# EAGLE schematic PKG900000001454 (EAGLE 7.7.0)

## Sheet 1 of 5
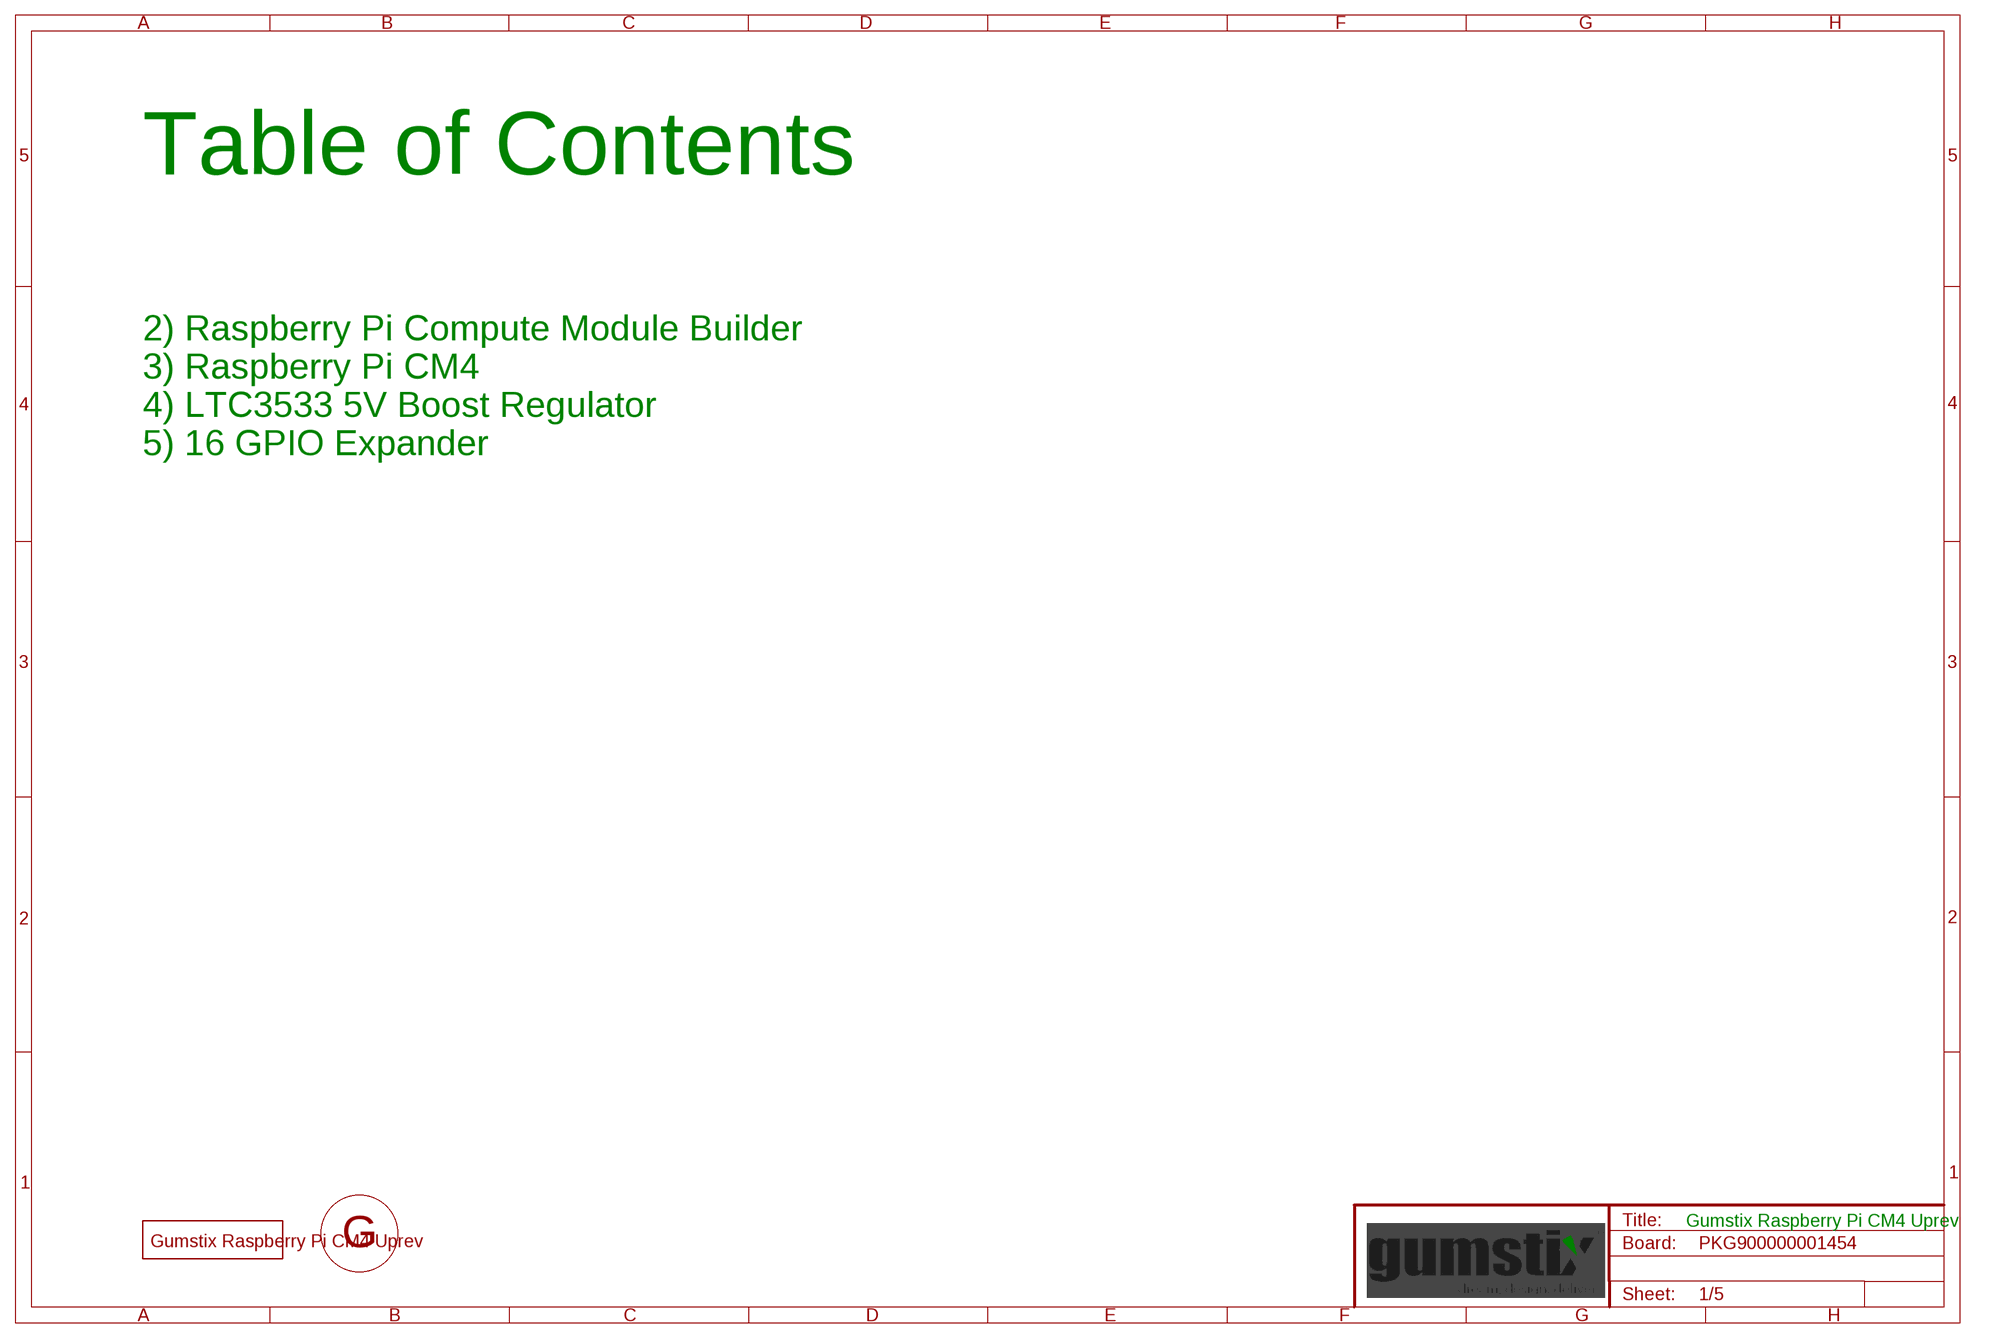
[diagram p0: schematic, sheet 1]

### Parts
FD1  DNP  FIDUCIAL  [FIDUCIAL]
FD2  DNP  FIDUCIAL  [FIDUCIAL]
FD3  DNP  FIDUCIAL  [FIDUCIAL]
FD4  DNP  FIDUCIAL  [FIDUCIAL]
FD5  DNP  FIDUCIAL  [FIDUCIAL]
FD6  DNP  FIDUCIAL  [FIDUCIAL]
U$3  DNP  GEPPETTO_LABEL"  [GEPPETTO_LABEL]
U$4  DNP  GEPPETTO_LOGO10X10  [GEPPETTO_LOGO_SILK10]

### Notes on the sheet
- Table of Contents
- 2) Raspberry Pi Compute Module Builder
- 3) Raspberry Pi CM4
- 4) LTC3533 5V Boost Regulator
- 5) 16 GPIO Expander
- Gumstix Raspberry Pi CM4 Uprev

## Sheet 2 of 5
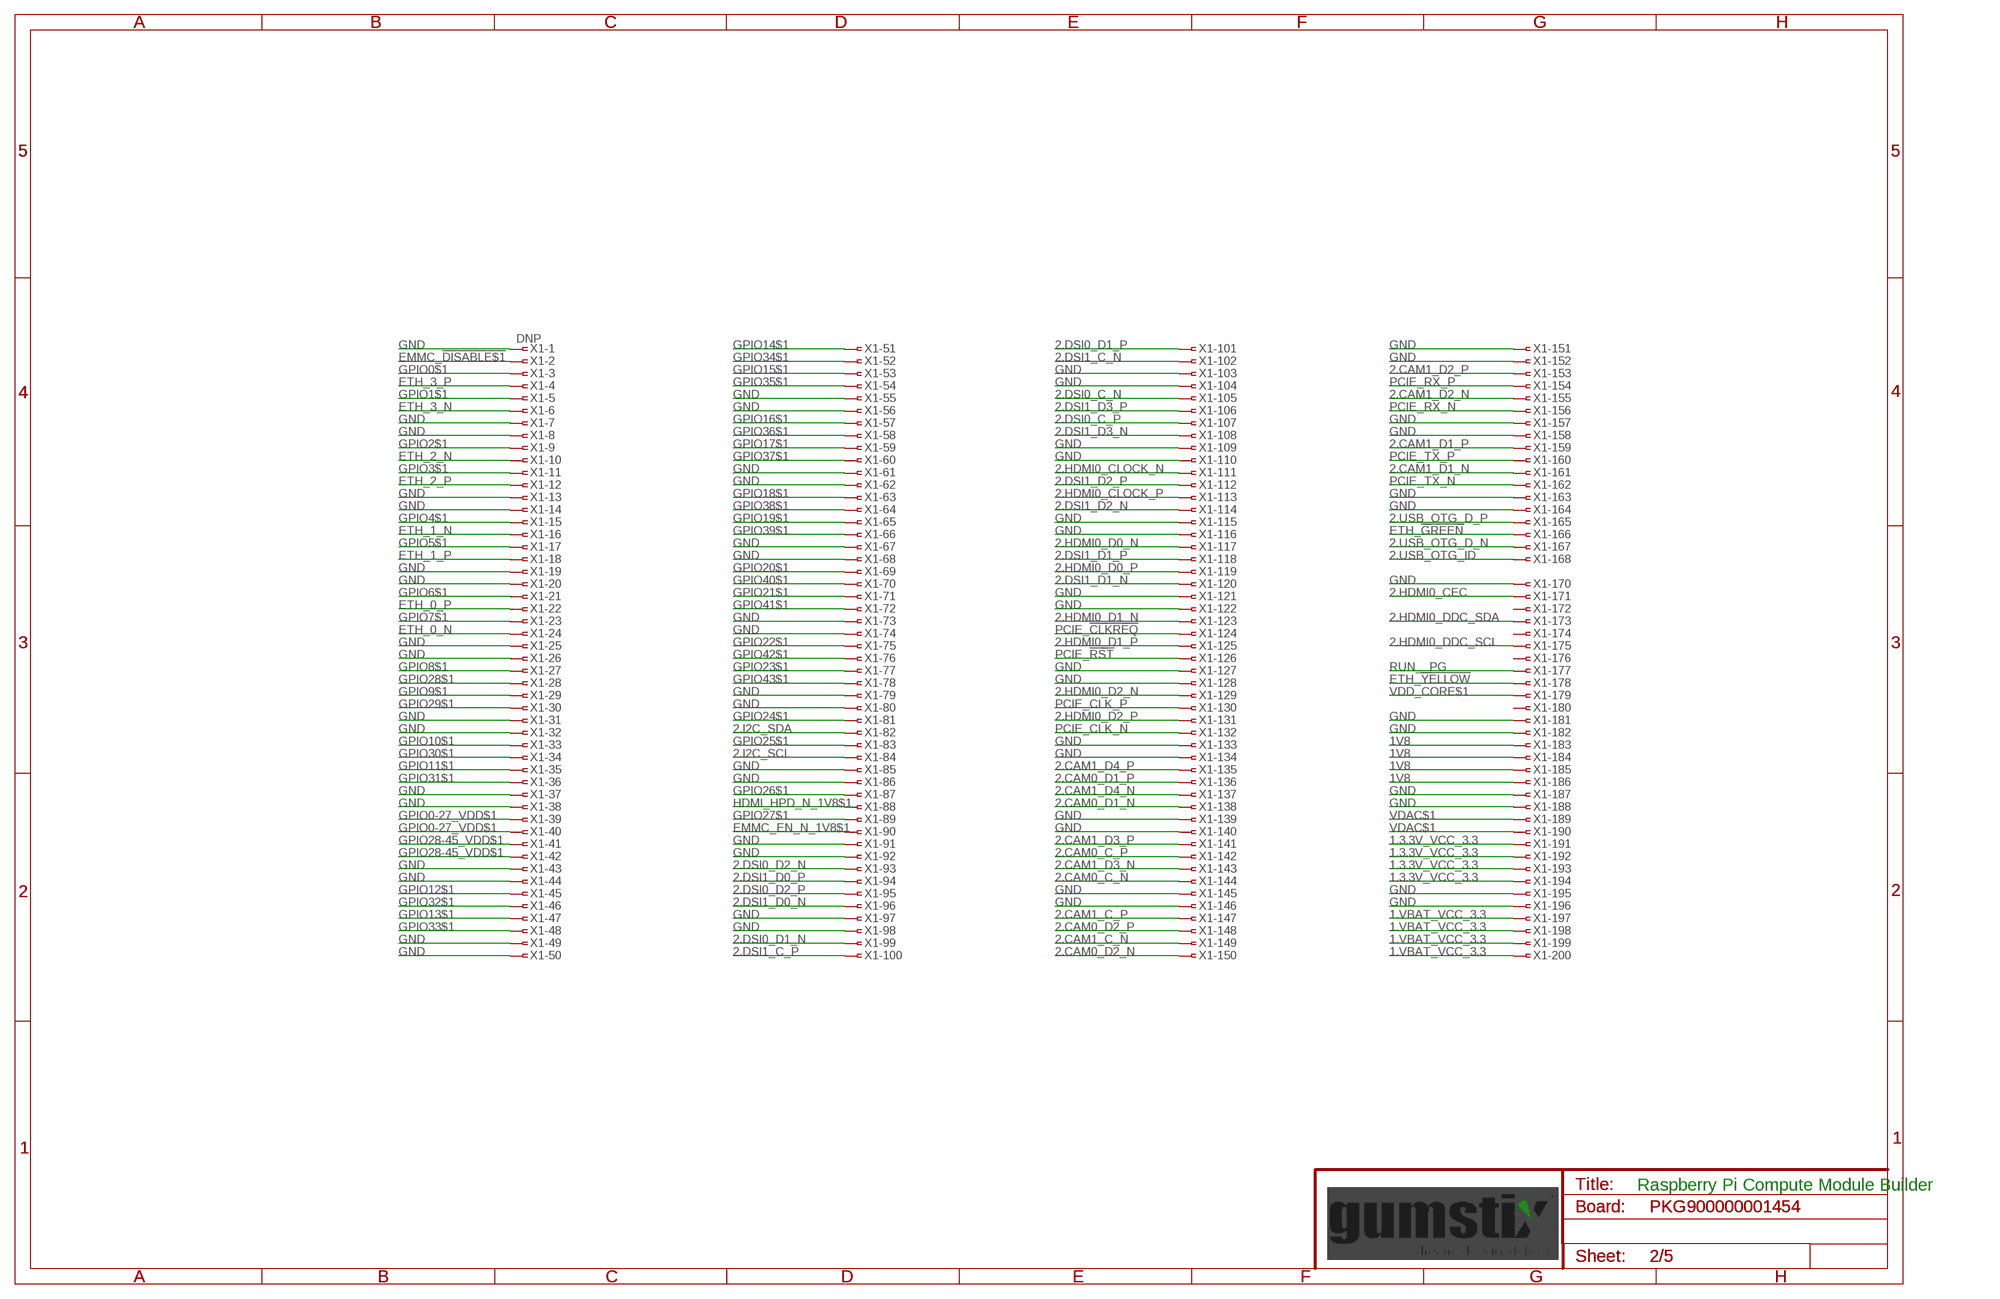
[diagram p1: schematic, sheet 2]

### Parts
X1  DNP  1376408SLOT_1.8V_MOD  [SLOT-1376408-1_1.8V_MOD]

### Nets
1.3.3V_VCC_3.3 [supply]: X1.191 X1.192 X1.193 X1.194 ; also sheet 3,5
1.VBAT_VCC_3.3 [supply]: X1.197 X1.198 X1.199 X1.200 ; also sheet 4
1V8 [supply]: X1.183 X1.184 X1.185 X1.186
2.CAM0_C_N [HDMI]: X1.144 ; also sheet 3
2.CAM0_C_P [HDMI]: X1.142 ; also sheet 3
2.CAM0_D1_N [HDMI]: X1.138 ; also sheet 3
2.CAM0_D1_P [HDMI]: X1.136 ; also sheet 3
2.CAM0_D2_N [HDMI]: X1.150 ; also sheet 3
2.CAM0_D2_P [HDMI]: X1.148 ; also sheet 3
2.CAM1_C_N [HDMI]: X1.149 ; also sheet 3
2.CAM1_C_P [HDMI]: X1.147 ; also sheet 3
2.CAM1_D1_N [HDMI]: X1.161 ; also sheet 3
2.CAM1_D1_P [HDMI]: X1.159 ; also sheet 3
2.CAM1_D2_N [HDMI]: X1.155 ; also sheet 3
2.CAM1_D2_P [HDMI]: X1.153 ; also sheet 3
2.CAM1_D3_N [HDMI]: X1.143 ; also sheet 3
2.CAM1_D3_P [HDMI]: X1.141 ; also sheet 3
2.CAM1_D4_N [HDMI]: X1.137 ; also sheet 3
2.CAM1_D4_P [HDMI]: X1.135 ; also sheet 3
2.DSI0_C_N [HDMI]: X1.105 ; also sheet 3
2.DSI0_C_P [HDMI]: X1.107 ; also sheet 3
2.DSI0_D1_N [HDMI]: X1.99 ; also sheet 3
2.DSI0_D1_P [HDMI]: X1.101 ; also sheet 3
2.DSI0_D2_N [HDMI]: X1.93 ; also sheet 3
2.DSI0_D2_P [HDMI]: X1.95 ; also sheet 3
2.DSI1_C_N [HDMI]: X1.102 ; also sheet 3
2.DSI1_C_P [HDMI]: X1.100 ; also sheet 3
2.DSI1_D0_N [HDMI]: X1.96 ; also sheet 3
2.DSI1_D0_P [HDMI]: X1.94 ; also sheet 3
2.DSI1_D1_N [HDMI]: X1.120 ; also sheet 3
2.DSI1_D1_P [HDMI]: X1.118 ; also sheet 3
2.DSI1_D2_N [HDMI]: X1.114 ; also sheet 3
2.DSI1_D2_P [HDMI]: X1.112 ; also sheet 3
2.DSI1_D3_N [HDMI]: X1.108 ; also sheet 3
2.DSI1_D3_P [HDMI]: X1.106 ; also sheet 3
2.HDMI0_CEC: X1.171 ; also sheet 3
2.HDMI0_CLOCK_N [HDMI]: X1.111 ; also sheet 3
2.HDMI0_CLOCK_P [HDMI]: X1.113 ; also sheet 3
2.HDMI0_D0_N [HDMI]: X1.117 ; also sheet 3
2.HDMI0_D0_P [HDMI]: X1.119 ; also sheet 3
2.HDMI0_D1_N [HDMI]: X1.123 ; also sheet 3
2.HDMI0_D1_P [HDMI]: X1.125 ; also sheet 3
2.HDMI0_D2_N [HDMI]: X1.129 ; also sheet 3
2.HDMI0_D2_P [HDMI]: X1.131 ; also sheet 3
2.HDMI0_DDC_SCL: X1.175 ; also sheet 3
2.HDMI0_DDC_SDA: X1.173 ; also sheet 3
2.I2C_SCL: X1.84 ; also sheet 3
2.I2C_SDA: X1.82 ; also sheet 3
2.USB_OTG_D_N [USB]: X1.167 ; also sheet 3
2.USB_OTG_D_P [USB]: X1.165 ; also sheet 3
2.USB_OTG_ID: X1.168 ; also sheet 3
EMMC_!DISABLE$1: X1.2 ; also sheet 3
EMMC_EN_N_1V8$1: X1.90
ETH_0_N [HDMI]: X1.24 ; also sheet 3
ETH_0_P [HDMI]: X1.22 ; also sheet 3
ETH_1_N [HDMI]: X1.16 ; also sheet 3
ETH_1_P [HDMI]: X1.18 ; also sheet 3
ETH_2_N [HDMI]: X1.10 ; also sheet 3
ETH_2_P [HDMI]: X1.12 ; also sheet 3
ETH_3_N [HDMI]: X1.6 ; also sheet 3
ETH_3_P [HDMI]: X1.4 ; also sheet 3
ETH_!GREEN: X1.166 ; also sheet 3
ETH_!YELLOW: X1.178 ; also sheet 3
GND [supply]: X1.1 X1.7 X1.8 X1.13 X1.14 X1.19 X1.20 X1.25 X1.26 X1.31 X1.32 X1.37 X1.38 X1.43 X1.44 X1.49 X1.50 X1.55 X1.56 X1.61 X1.62 X1.67 X1.68 X1.73 X1.74 X1.79 X1.80 X1.85 X1.86 X1.91 X1.92 X1.97 X1.98 X1.103 X1.104 X1.109 X1.110 X1.115 X1.116 X1.121 X1.122 X1.127 X1.128 X1.133 X1.134 X1.139 X1.140 X1.145 X1.146 X1.151 X1.152 X1.157 X1.158 X1.163 X1.164 X1.170 X1.181 X1.182 X1.187 X1.188 X1.195 X1.196 ; also sheet 3,4,5
GPIO0$1: X1.3 ; also sheet 3
GPIO0-27_VDD$1 [supply]: X1.39 X1.40
GPIO1$1: X1.5 ; also sheet 3
GPIO2$1: X1.9 ; also sheet 3,5
GPIO3$1: X1.11 ; also sheet 3,5
GPIO4$1: X1.15 ; also sheet 3
GPIO5$1: X1.17 ; also sheet 3
GPIO6$1: X1.21 ; also sheet 3
GPIO7$1: X1.23 ; also sheet 3
GPIO8$1: X1.27 ; also sheet 3
GPIO9$1: X1.29 ; also sheet 3
GPIO10$1: X1.33 ; also sheet 3
GPIO11$1: X1.35 ; also sheet 3
GPIO12$1: X1.45 ; also sheet 3
GPIO13$1: X1.47 ; also sheet 3
GPIO14$1: X1.51 ; also sheet 3
GPIO15$1: X1.53 ; also sheet 3
GPIO16$1: X1.57 ; also sheet 3
GPIO17$1: X1.59 ; also sheet 3
GPIO18$1: X1.63 ; also sheet 3
GPIO19$1: X1.65 ; also sheet 3
GPIO20$1: X1.69 ; also sheet 3
GPIO21$1: X1.71 ; also sheet 3
GPIO22$1: X1.75 ; also sheet 3
GPIO23$1: X1.77 ; also sheet 3
GPIO24$1: X1.81 ; also sheet 3
GPIO25$1: X1.83 ; also sheet 3
GPIO26$1: X1.87 ; also sheet 3
GPIO27$1: X1.89 ; also sheet 3
GPIO28$1: X1.28 ; also sheet 5
GPIO28-45_VDD$1 [supply]: X1.41 X1.42
GPIO29$1: X1.30 ; also sheet 5
GPIO30$1: X1.34 ; also sheet 5
GPIO31$1: X1.36 ; also sheet 5
GPIO32$1: X1.46 ; also sheet 5
GPIO33$1: X1.48 ; also sheet 5
GPIO34$1: X1.52 ; also sheet 5
GPIO35$1: X1.54 ; also sheet 5
GPIO36$1: X1.58 ; also sheet 5
GPIO37$1: X1.60 ; also sheet 5
GPIO38$1: X1.64 ; also sheet 5
GPIO39$1: X1.66 ; also sheet 5
GPIO40$1: X1.70 ; also sheet 5
GPIO41$1: X1.72 ; also sheet 5
GPIO42$1: X1.76 ; also sheet 5
GPIO43$1: X1.78 ; also sheet 5
HDMI_HPD_N_1V8$1: X1.88 ; also sheet 3
PCIE_!CLKREQ: X1.124 ; also sheet 3
PCIE_!RST: X1.126 ; also sheet 3
PCIE_CLK_N [USB]: X1.132 ; also sheet 3
PCIE_CLK_P [USB]: X1.130 ; also sheet 3
PCIE_RX_N [USB]: X1.156 ; also sheet 3
PCIE_RX_P [USB]: X1.154 ; also sheet 3
PCIE_TX_N [USB]: X1.162 ; also sheet 3
PCIE_TX_P [USB]: X1.160 ; also sheet 3
RUN__PG: X1.177 ; also sheet 3
VDAC$1 [supply]: X1.189 X1.190
VDD_CORE$1: X1.179
Unconnected: X1.169 X1.172 X1.174 X1.176 X1.180

### Notes on the sheet
- Raspberry Pi Compute Module Builder

## Sheet 3 of 5
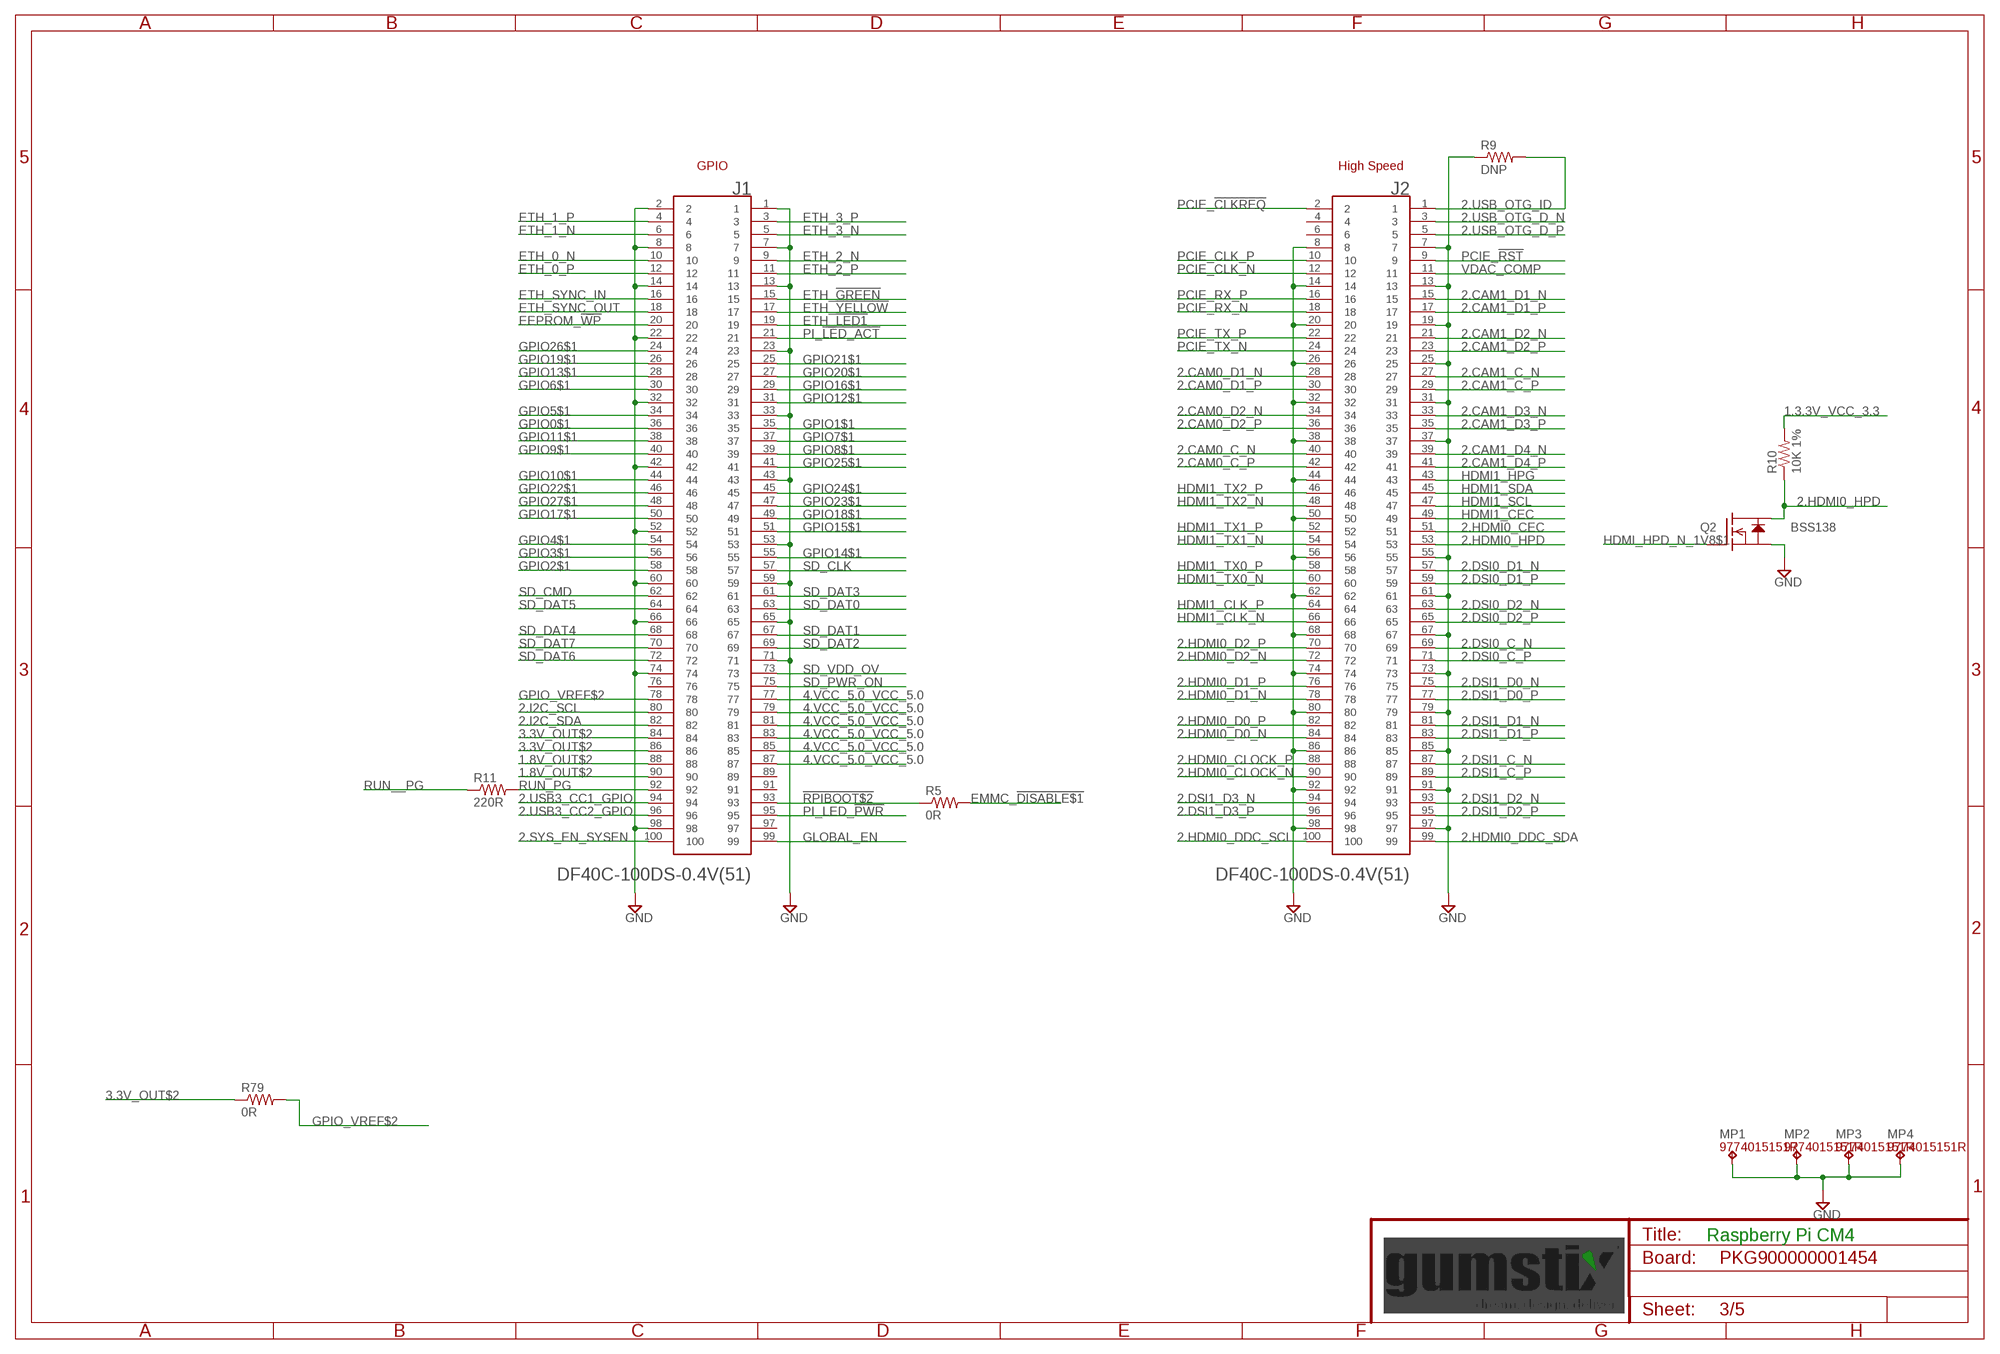
[diagram p2: schematic, sheet 3]

### Parts
J1  DF40C-100DS-0.4V(51)  [HRS_DF40C-100DS-0.4V(51)]
J2  DF40C-100DS-0.4V(51)  [HRS_DF40C-100DS-0.4V(51)]
MP1  9774015151R  BULLET_CONN2.5MM  [WA-SMSI_9774___151]
MP2  9774015151R  BULLET_CONN2.5MM  [WA-SMSI_9774___151]
MP3  9774015151R  BULLET_CONN2.5MM  [WA-SMSI_9774___151]
MP4  9774015151R  BULLET_CONN2.5MM  [WA-SMSI_9774___151]
Q2  BSS138  [SOT23]
R5  0R  R0201  [0201]
R9  DNP  R0201  [0201]
R10  10K 1%  R0201  [0201]
R11  220R  R0402  [0402]
R79  0R  R0201  [0201]

### Nets
1.3.3V_VCC_3.3 [supply]: R10.2 ; also sheet 2,5
1.8V_OUT$2 [supply]: J1.88 J1.90
2.CAM0_C_N [HDMI]: J2.40 ; also sheet 2
2.CAM0_C_P [HDMI]: J2.42 ; also sheet 2
2.CAM0_D1_N [HDMI]: J2.28 ; also sheet 2
2.CAM0_D1_P [HDMI]: J2.30 ; also sheet 2
2.CAM0_D2_N [HDMI]: J2.34 ; also sheet 2
2.CAM0_D2_P [HDMI]: J2.36 ; also sheet 2
2.CAM1_C_N [HDMI]: J2.27 ; also sheet 2
2.CAM1_C_P [HDMI]: J2.29 ; also sheet 2
2.CAM1_D1_N [HDMI]: J2.15 ; also sheet 2
2.CAM1_D1_P [HDMI]: J2.17 ; also sheet 2
2.CAM1_D2_N [HDMI]: J2.21 ; also sheet 2
2.CAM1_D2_P [HDMI]: J2.23 ; also sheet 2
2.CAM1_D3_N [HDMI]: J2.33 ; also sheet 2
2.CAM1_D3_P [HDMI]: J2.35 ; also sheet 2
2.CAM1_D4_N [HDMI]: J2.39 ; also sheet 2
2.CAM1_D4_P [HDMI]: J2.41 ; also sheet 2
2.DSI0_C_N [HDMI]: J2.69 ; also sheet 2
2.DSI0_C_P [HDMI]: J2.71 ; also sheet 2
2.DSI0_D1_N [HDMI]: J2.57 ; also sheet 2
2.DSI0_D1_P [HDMI]: J2.59 ; also sheet 2
2.DSI0_D2_N [HDMI]: J2.63 ; also sheet 2
2.DSI0_D2_P [HDMI]: J2.65 ; also sheet 2
2.DSI1_C_N [HDMI]: J2.87 ; also sheet 2
2.DSI1_C_P [HDMI]: J2.89 ; also sheet 2
2.DSI1_D0_N [HDMI]: J2.75 ; also sheet 2
2.DSI1_D0_P [HDMI]: J2.77 ; also sheet 2
2.DSI1_D1_N [HDMI]: J2.81 ; also sheet 2
2.DSI1_D1_P [HDMI]: J2.83 ; also sheet 2
2.DSI1_D2_N [HDMI]: J2.93 ; also sheet 2
2.DSI1_D2_P [HDMI]: J2.95 ; also sheet 2
2.DSI1_D3_N [HDMI]: J2.94 ; also sheet 2
2.DSI1_D3_P [HDMI]: J2.96 ; also sheet 2
2.HDMI0_CEC: J2.51 ; also sheet 2
2.HDMI0_CLOCK_N [HDMI]: J2.90 ; also sheet 2
2.HDMI0_CLOCK_P [HDMI]: J2.88 ; also sheet 2
2.HDMI0_D0_N [HDMI]: J2.84 ; also sheet 2
2.HDMI0_D0_P [HDMI]: J2.82 ; also sheet 2
2.HDMI0_D1_N [HDMI]: J2.78 ; also sheet 2
2.HDMI0_D1_P [HDMI]: J2.76 ; also sheet 2
2.HDMI0_D2_N [HDMI]: J2.72 ; also sheet 2
2.HDMI0_D2_P [HDMI]: J2.70 ; also sheet 2
2.HDMI0_DDC_SCL: J2.100 ; also sheet 2
2.HDMI0_DDC_SDA: J2.99 ; also sheet 2
2.HDMI0_HPD: J2.53 Q2.3(D) R10.1
2.I2C_SCL: J1.80 ; also sheet 2
2.I2C_SDA: J1.82 ; also sheet 2
2.SYS_EN_SYSEN: J1.100
2.USB3_CC1_GPIO: J1.94
2.USB3_CC2_GPIO: J1.96
2.USB_OTG_D_N [USB]: J2.3 ; also sheet 2
2.USB_OTG_D_P [USB]: J2.5 ; also sheet 2
2.USB_OTG_ID: J2.1 R9.2 ; also sheet 2
3.3V_OUT$2 [supply]: J1.84 J1.86 R79.1
4.VCC_5.0_VCC_5.0 [supply]: J1.77 J1.79 J1.81 J1.83 J1.85 J1.87 ; also sheet 4
!RPIBOOT$2: J1.93 R5.1
EEPROM_!WP: J1.20
EMMC_!DISABLE$1: R5.2 ; also sheet 2
ETH_0_N [HDMI]: J1.10 ; also sheet 2
ETH_0_P [HDMI]: J1.12 ; also sheet 2
ETH_1_N [HDMI]: J1.6 ; also sheet 2
ETH_1_P [HDMI]: J1.4 ; also sheet 2
ETH_2_N [HDMI]: J1.9 ; also sheet 2
ETH_2_P [HDMI]: J1.11 ; also sheet 2
ETH_3_N [HDMI]: J1.5 ; also sheet 2
ETH_3_P [HDMI]: J1.3 ; also sheet 2
ETH_!GREEN: J1.15 ; also sheet 2
ETH_!LED1: J1.19
ETH_!YELLOW: J1.17 ; also sheet 2
ETH_SYNC_IN: J1.16
ETH_SYNC_OUT: J1.18
GLOBAL_EN: J1.99
GND [supply]: J1.1 J1.2 J1.7 J1.8 J1.13 J1.14 J1.22 J1.23 J1.32 J1.33 J1.42 J1.43 J1.52 J1.53 J1.59 J1.60 J1.65 J1.66 J1.71 J1.74 J1.98 J2.7 J2.8 J2.13 J2.14 J2.19 J2.20 J2.25 J2.26 J2.31 J2.32 J2.37 J2.38 J2.44 J2.50 J2.55 J2.56 J2.61 J2.62 J2.67 J2.68 J2.73 J2.74 J2.79 J2.80 J2.85 J2.86 J2.91 J2.92 J2.97 J2.98 MP1.1(TP) MP2.1(TP) MP3.1(TP) MP4.1(TP) Q2.2(S) R9.1 ; also sheet 2,4,5
GPIO0$1: J1.36 ; also sheet 2
GPIO1$1: J1.35 ; also sheet 2
GPIO2$1: J1.58 ; also sheet 2,5
GPIO3$1: J1.56 ; also sheet 2,5
GPIO4$1: J1.54 ; also sheet 2
GPIO5$1: J1.34 ; also sheet 2
GPIO6$1: J1.30 ; also sheet 2
GPIO7$1: J1.37 ; also sheet 2
GPIO8$1: J1.39 ; also sheet 2
GPIO9$1: J1.40 ; also sheet 2
GPIO10$1: J1.44 ; also sheet 2
GPIO11$1: J1.38 ; also sheet 2
GPIO12$1: J1.31 ; also sheet 2
GPIO13$1: J1.28 ; also sheet 2
GPIO14$1: J1.55 ; also sheet 2
GPIO15$1: J1.51 ; also sheet 2
GPIO16$1: J1.29 ; also sheet 2
GPIO17$1: J1.50 ; also sheet 2
GPIO18$1: J1.49 ; also sheet 2
GPIO19$1: J1.26 ; also sheet 2
GPIO20$1: J1.27 ; also sheet 2
GPIO21$1: J1.25 ; also sheet 2
GPIO22$1: J1.46 ; also sheet 2
GPIO23$1: J1.47 ; also sheet 2
GPIO24$1: J1.45 ; also sheet 2
GPIO25$1: J1.41 ; also sheet 2
GPIO26$1: J1.24 ; also sheet 2
GPIO27$1: J1.48 ; also sheet 2
GPIO_VREF$2 [supply]: J1.78 R79.2
HDMI1_CEC: J2.49
HDMI1_CLK_N [HDMI]: J2.66
HDMI1_CLK_P [HDMI]: J2.64
HDMI1_HPG: J2.43
HDMI1_SCL: J2.47
HDMI1_SDA: J2.45
HDMI1_TX0_N [HDMI]: J2.60
HDMI1_TX0_P [HDMI]: J2.58
HDMI1_TX1_N [HDMI]: J2.54
HDMI1_TX1_P [HDMI]: J2.52
HDMI1_TX2_N [HDMI]: J2.48
HDMI1_TX2_P [HDMI]: J2.46
HDMI_HPD_N_1V8$1: Q2.1(G) ; also sheet 2
PCIE_!CLKREQ: J2.2 ; also sheet 2
PCIE_!RST: J2.9 ; also sheet 2
PCIE_CLK_N [USB]: J2.12 ; also sheet 2
PCIE_CLK_P [USB]: J2.10 ; also sheet 2
PCIE_RX_N [USB]: J2.18 ; also sheet 2
PCIE_RX_P [USB]: J2.16 ; also sheet 2
PCIE_TX_N [USB]: J2.24 ; also sheet 2
PCIE_TX_P [USB]: J2.22 ; also sheet 2
PI_!LED_ACT: J1.21
PI_LED_!PWR: J1.95
RUN__PG: R11.1 ; also sheet 2
RUN_PG: J1.92 R11.2
SD_CLK: J1.57
SD_CMD: J1.62
SD_DAT0: J1.63
SD_DAT1: J1.67
SD_DAT2: J1.69
SD_DAT3: J1.61
SD_DAT4: J1.68
SD_DAT5: J1.64
SD_DAT6: J1.72
SD_DAT7: J1.70
SD_PWR_ON: J1.75
SD_VDD_OV: J1.73
VDAC_COMP: J2.11
Unconnected: J1.76 J1.89 J1.91 J1.97 J2.4 J2.6

### Notes on the sheet
- GPIO | High Speed
- Raspberry Pi CM4

## Sheet 4 of 5
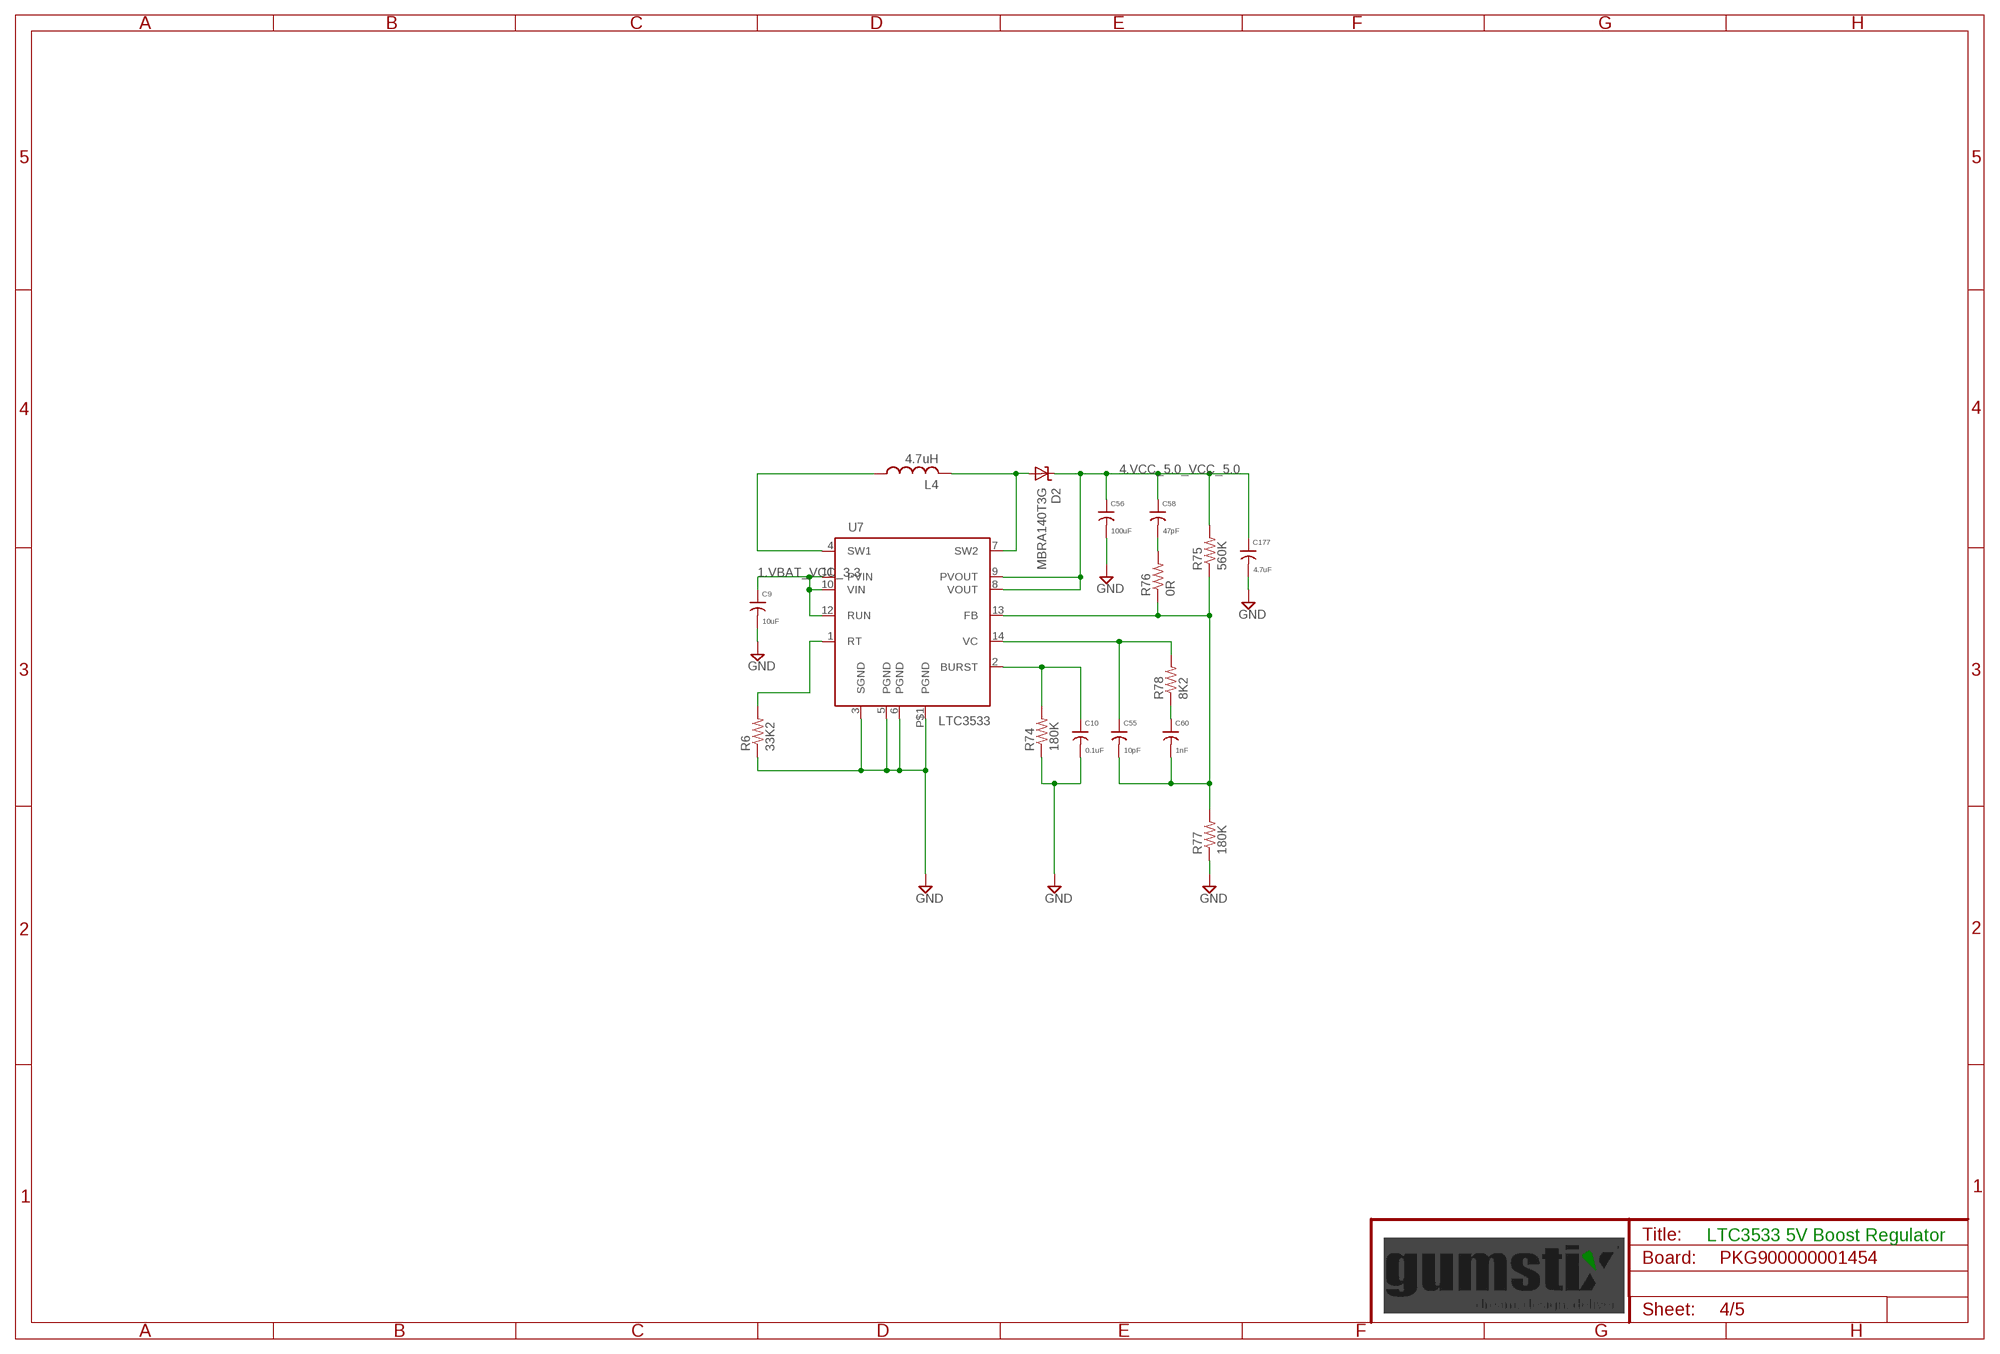
[diagram p3: schematic, sheet 4]

### Parts
C9  10uF  C0603  [0603]
C10  0.1uF  C0201  [0201]
C55  10pF  C0201  [0201]
C56  100uF  C1206  [1206]
C58  47pF  C0201  [0201]
C60  1nF  C0402  [0402]
C177  4.7uF  C0603  [0603]
D2  MBRA140T3G  DSMA  [SMAJ]
L4  4.7uH  L82462  [B82462]
R6  33K2  R0402  [0402]
R74  180K  R0201  [0201]
R75  560K  R0402  [0402]
R76  0R  R0201  [0201]
R77  180K  R0201  [0201]
R78  8K2  R0402  [0402]
U7  LTC3533  [DFN-14]

### Nets
1.VBAT_VCC_3.3 [supply]: C9.1 U7.10(VIN) U7.11(PVIN) U7.12(RUN) ; also sheet 2
4.VCC_5.0_VCC_5.0 [supply]: C56.1 C58.1 C177.1 D2.C R75.2 U7.8(VOUT) U7.9(PVOUT) ; also sheet 3
BURST$3: C10.1 R74.2 U7.2(BURST)
FB_5$3: C55.2 C60.2 R75.1 R76.1 R77.2 U7.13(FB)
FB_5A$3: C58.2 R76.2
GND [supply]: C9.2 C10.2 C56.2 C177.2 R6.1 R74.1 R77.1 U7.3(SGND) U7.5(PGND) U7.6(PGND) U7.P$1(PGND) ; also sheet 2,3,5
PRE_FB$3: C60.1 R78.1
RT$3: R6.2 U7.1(RT)
SW1$3: L4.1 U7.4(SW1)
SW2$3: D2.A L4.2 U7.7(SW2)
VC$3: C55.1 R78.2 U7.14(VC)

### Notes on the sheet
- LTC3533 5V Boost Regulator

## Sheet 5 of 5
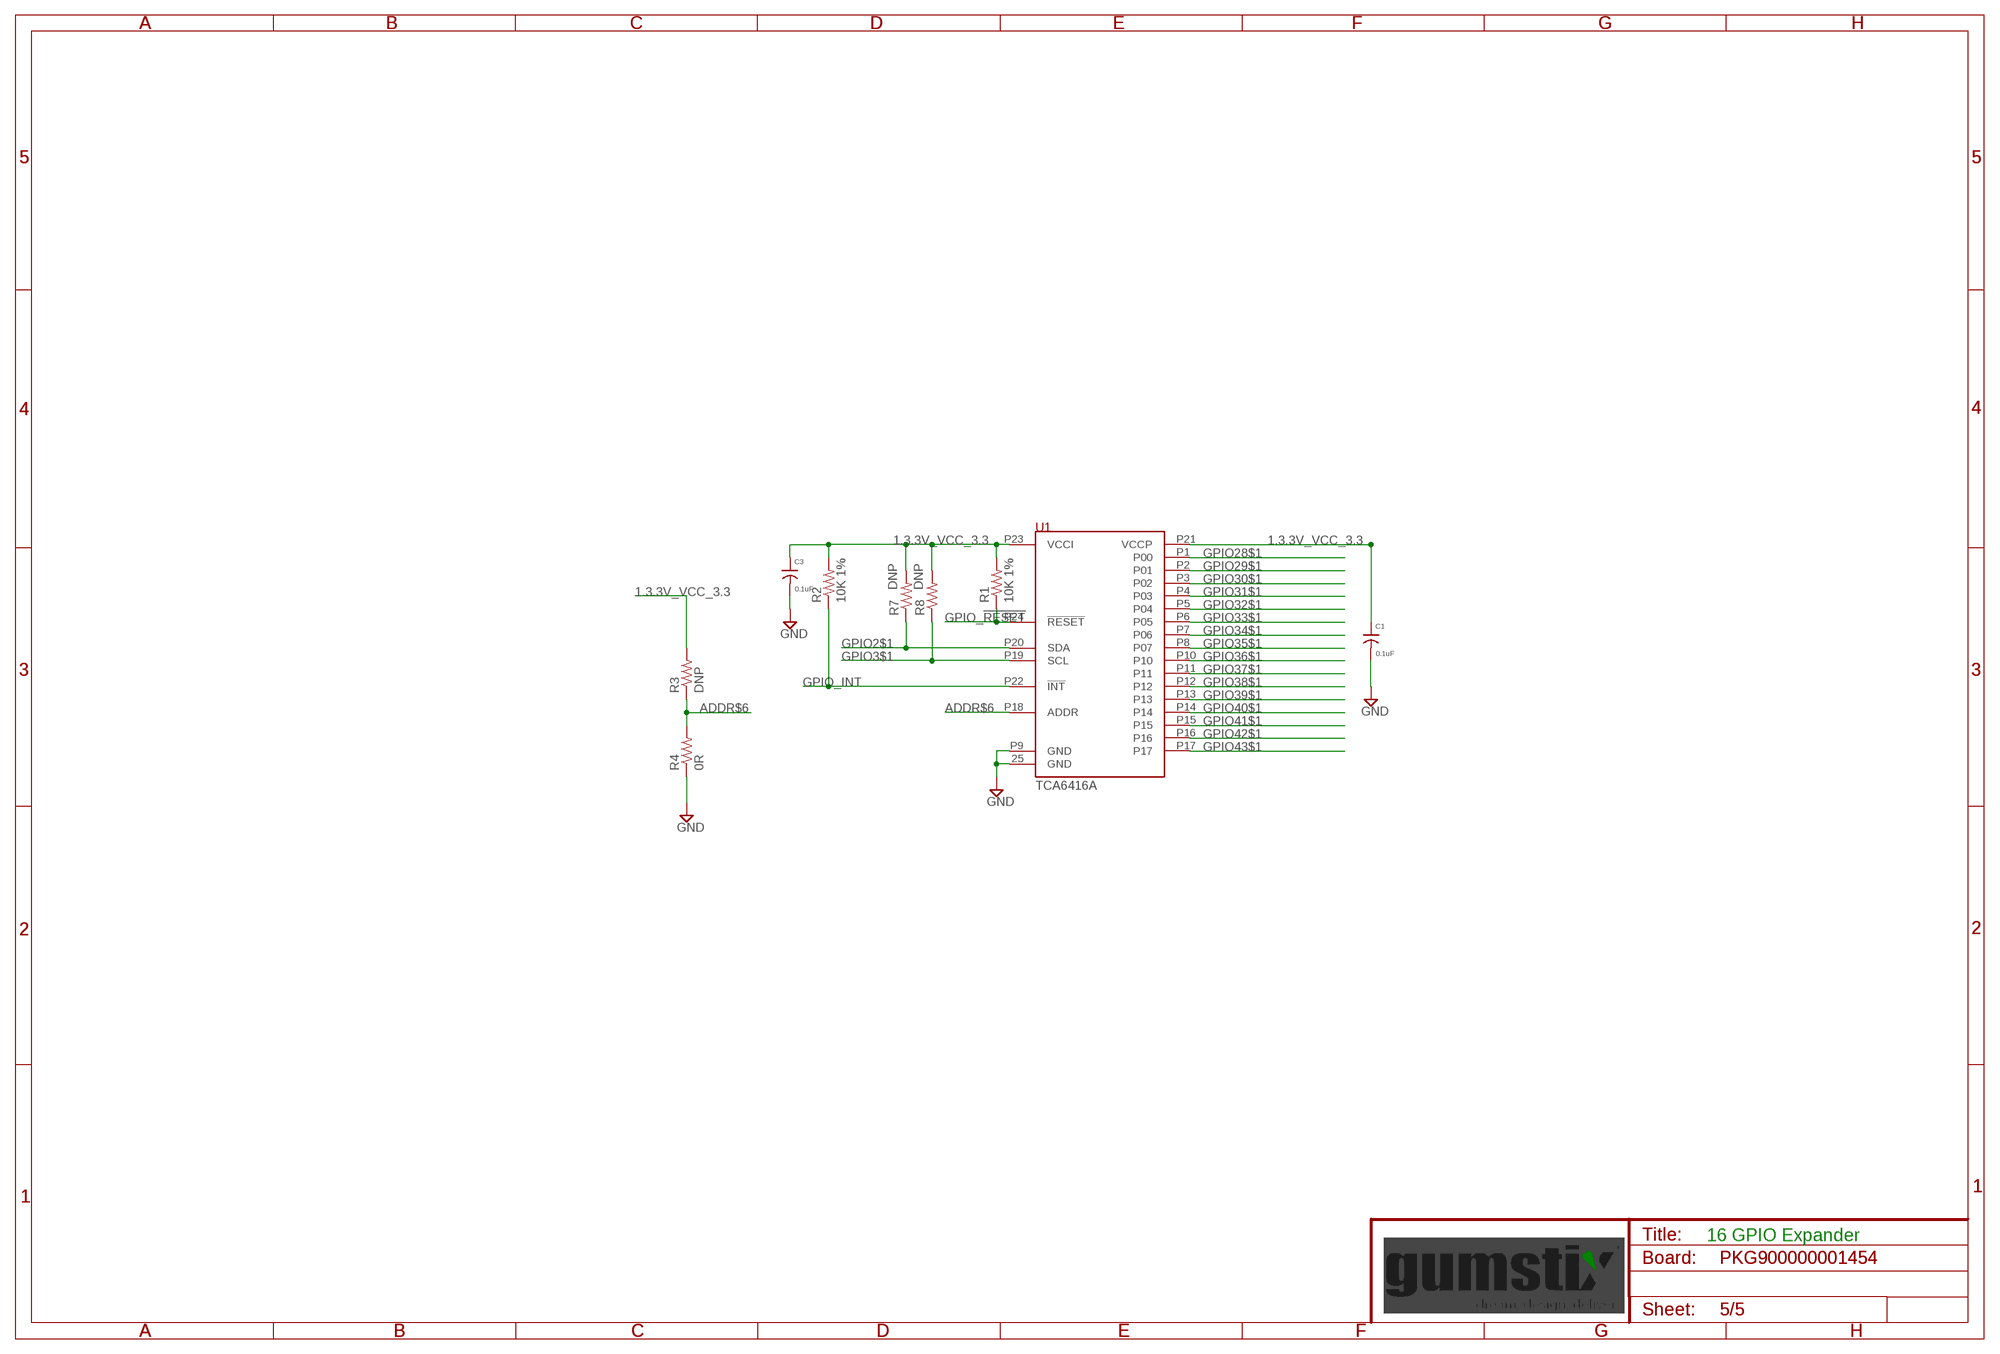
[diagram p4: schematic, sheet 5]

### Parts
C1  0.1uF  C0201  [0201]
C3  0.1uF  C0201  [0201]
R1  10K 1%  R0201  [0201]
R2  10K 1%  R0201  [0201]
R3  DNP  R0201  [0201]
R4  0R  R0201  [0201]
R7  DNP  R0201  [0201]
R8  DNP  R0201  [0201]
U1  TCA6416A  [WQFN24]

### Nets
1.3.3V_VCC_3.3 [supply]: C1.1 C3.1 R1.2 R2.2 R3.2 R7.2 R8.2 U1.P21(VCCP) U1.P23(VCCI) ; also sheet 2,3
ADDR$6: R3.1 R4.2 U1.P18(ADDR)
GND [supply]: C1.2 C3.2 R4.1 U1.25(GND) U1.P9(GND) ; also sheet 2,3,4
GPIO2$1: R7.1 U1.P20(SDA) ; also sheet 2,3
GPIO3$1: R8.1 U1.P19(SCL) ; also sheet 2,3
GPIO28$1: U1.P1(P00) ; also sheet 2
GPIO29$1: U1.P2(P01) ; also sheet 2
GPIO30$1: U1.P3(P02) ; also sheet 2
GPIO31$1: U1.P4(P03) ; also sheet 2
GPIO32$1: U1.P5(P04) ; also sheet 2
GPIO33$1: U1.P6(P05) ; also sheet 2
GPIO34$1: U1.P7(P06) ; also sheet 2
GPIO35$1: U1.P8(P07) ; also sheet 2
GPIO36$1: U1.P10 ; also sheet 2
GPIO37$1: U1.P11 ; also sheet 2
GPIO38$1: U1.P12 ; also sheet 2
GPIO39$1: U1.P13 ; also sheet 2
GPIO40$1: U1.P14 ; also sheet 2
GPIO41$1: U1.P15 ; also sheet 2
GPIO42$1: U1.P16 ; also sheet 2
GPIO43$1: U1.P17 ; also sheet 2
GPIO_!RESET: R1.1 U1.P24(!RESET!)
GPIO_INT: R2.1 U1.P22(!INT!)

### Notes on the sheet
- 16 GPIO Expander

## Library data of the parts
C1 C3 C10 C55 C58 = qualified_1:C; HEIGHT: 0.25
C9 C177 = qualified_1:C; HEIGHT: 0.5
C56 = qualified_1:C; HEIGHT: 0.51
C60 = qualified_1:C; HEIGHT: 0.35
D2 = qualified_1:D
FD1-FD6 = qualified_1:FIDUCIAL; HEIGHT: 0
J1 J2 = qualified_1:DF40C-100DS-0.4V(51): DF40 Series 100 Position Dual Row 0.4 mm Pitch Surface Mount Vertical Receptacle; DESCRIPTION: DF40 Series 100 Position Dual Row 0.4 mm Pitch Surface Mount Vertical Receptacle; DIGI-KEY_PART_NUMBER: H11615CT-ND; DIGI-KEY_PURCHASE_URL: https://www.digikey.ca/product-detail/en/hirose-electric-co-ltd/DF40C-100DS-0.4V_51_/H11615CT-ND/1969495?utm_source=snapeda&utm_medium=aggregator&utm_campaign=symbol; MF: Hirose; MP: DF40C-100DS-0.4V_51_; PACKAGE: None
L4 = qualified_1:L; HEIGHT: 2
MP1-MP4 = qualified_1:BULLET_CONN: Bullet connector (for RC) solder pad.
Q2 = qualified_1:BSS138: N-Channel Enhancement MOSFET; HEIGHT: 1.12
R1-R5 R7-R10 R74 R76 R77 R79 = qualified_1:R; HEIGHT: 0.25
R6 R11 R75 R78 = qualified_1:R; HEIGHT: 0.35
U1 = qualified_1:TCA6416A
U7 = qualified_1:LTC3533
U$3 = qualified_1:GEPPETTO_LABEL; BOARD: PCB900000001454v2; TITLE: Gumstix Raspberry Pi CM4 Uprev; YEAR: 2020
U$4 = qualified_1:GEPPETTO_LOGO
X1 = qualified_1:1376408: DDR1 & DDR2 SODIMM SOCKET 0.6mm Pitch 200 Pos. Standard Profile, Standard Type (used on Kontron X-Board) Source: http://catalog.tycoelectronics.com .. JPN_CD_1376408_S.pdf

## Net classes
1 supply: width 0.254 mm
2 analog: width 0.178 mm
5 USB: width 0.2 mm, clearance 0.2 mm
6 HDMI: width 0.2 mm, clearance 0.3 mm
7 50_OHM: width 0.378 mm, clearance 0.3 mm